# Altium schematic sheet CH572Q-DG-R0.SchDoc
size 199 x 100 mm
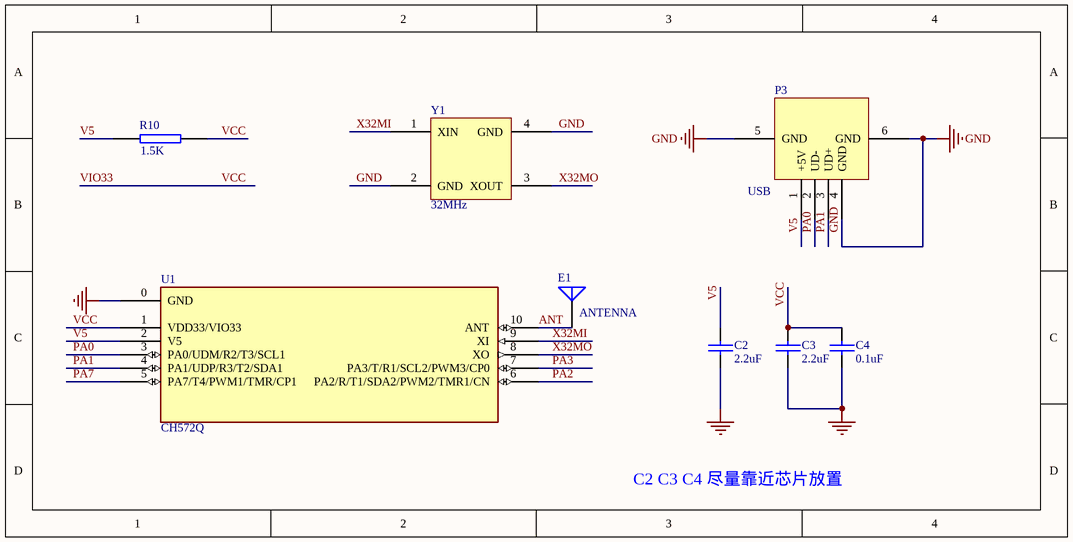
[diagram p0: CH572Q-DG-R0.SchDoc]

## Parts
C2  2.2uF  [0402_C]
C3  2.2uF  [0402_C]
C4  0.1uF  [0402_C]
E1  ANTENNA  [ANT-F-1-2.4G-0.8mmFR4]
P3  USB  [USBAM-4P]
R10  1.5K  [0402]
U1  CH572Q  [DFN10_3X3]
Y1  32MHz  [XT2016]

## Nets
GND: C2.2 C3.2 C4.2 P3.4(GND) P3.5(GND) P3.6(GND) U1.0(GND) Y1.2(GND) Y1.4(GND)
ANT: E1.1(A) U1.10(ANT)
PA0: P3.2(UD-) U1.3(PA0/UDM/R2/T3/SCL1)
PA1: P3.3(UD+) U1.4(PA1/UDP/R3/T2/SDA1)
PA2: U1.6(PA2/R/T1/SDA2/PWM2/TMR1/CN)
PA3: U1.7(PA3/T/R1/SCL2/PWM3/CP0)
PA7: U1.5(PA7/T4/PWM1/TMR/CP1)
V5: C2.1 P3.1(+5V) R10.1 U1.2(V5)
VCC: C3.1 C4.1 R10.2 U1.1(VDD33/VIO33)  [also labelled VIO33]
X32MI: U1.9(XI) Y1.1(XIN)
X32MO: U1.8(XO) Y1.3(XOUT)

## Notes on the sheet
- C2 C3 C4 尽量靠近芯片放置

## Library data of the parts
C2-C4 = CAP: Capacitor
E1 = ANTENNA: Generic Antenna
R10 = RES2
U1 = CH572Q: RISC-V MCU with BLE/2.4GHz Wireless/USB/UART/I2C/PWM/CMP
Y1 = 晶体